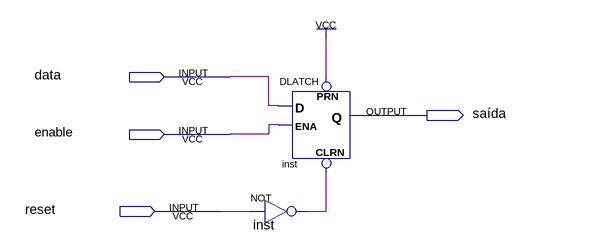
[diagram p0: schematic sheet]
// Quartus schematic mbr_latch.bdf as structural Verilog: 2 symbols, 4 pins
module mbr_latch (
  input  data,
  input  enable,
  input  reset,
  output \saída 
);

  wire inst_out;

  DLATCH inst (.CLRN(inst_out), .D(data), .ENA(enable), .PRN(1'b1), .Q(\saída ));
  not inst_dup2 (inst_out, reset);
endmodule
